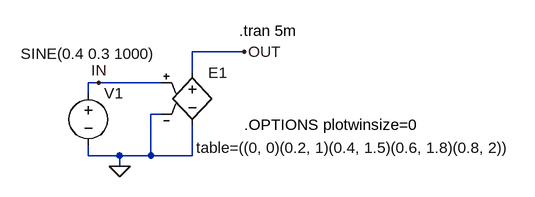
[diagram p0: schematic Fig_2-72_E-source-TABLE.asc]
Fig_2-72_E-source-TABLE.asc, the LTspice schematic file:
Version 4
SHEET 1 944 680
WIRE 368 112 288 112
WIRE 288 144 288 112
WIRE 144 160 128 160
WIRE 240 160 144 160
WIRE 128 176 128 160
WIRE 240 208 224 208
WIRE 128 272 128 256
WIRE 176 272 128 272
WIRE 224 272 224 208
WIRE 224 272 176 272
WIRE 288 272 288 224
WIRE 288 272 224 272
WIRE 176 288 176 272
FLAG 176 288 0
FLAG 368 112 OUT
FLAG 144 160 IN
SYMBOL e 288 128 R0
WINDOW 3 6 132 Left 2
SYMATTR InstName E1
SYMATTR Value table=((0, 0)(0.2, 1)(0.4, 1.5)(0.6, 1.8)(0.8, 2))
SYMBOL voltage 128 160 R0
WINDOW 3 -104 -45 Left 2
WINDOW 123 0 0 Left 0
WINDOW 39 0 0 Left 0
SYMATTR Value SINE(0.4 0.3 1000)
SYMATTR InstName V1
TEXT 360 80 Left 2 !.tran 5m
TEXT 368 224 Left 2 !.OPTIONS plotwinsize=0

The netlist it stands for:
* Fig_2-72_E-source-TABLE.asc
E1 OUT 0 IN 0 table=((0, 0)(0.2, 1)(0.4, 1.5)(0.6, 1.8)(0.8, 2))
V1 IN 0 SINE(0.4 0.3 1000)
.tran 5m
.OPTIONS plotwinsize=0
.backanno
.end